# EAGLE schematic SparkFun_MP3_Breakout-VS1033D (EAGLE 7.2.0)
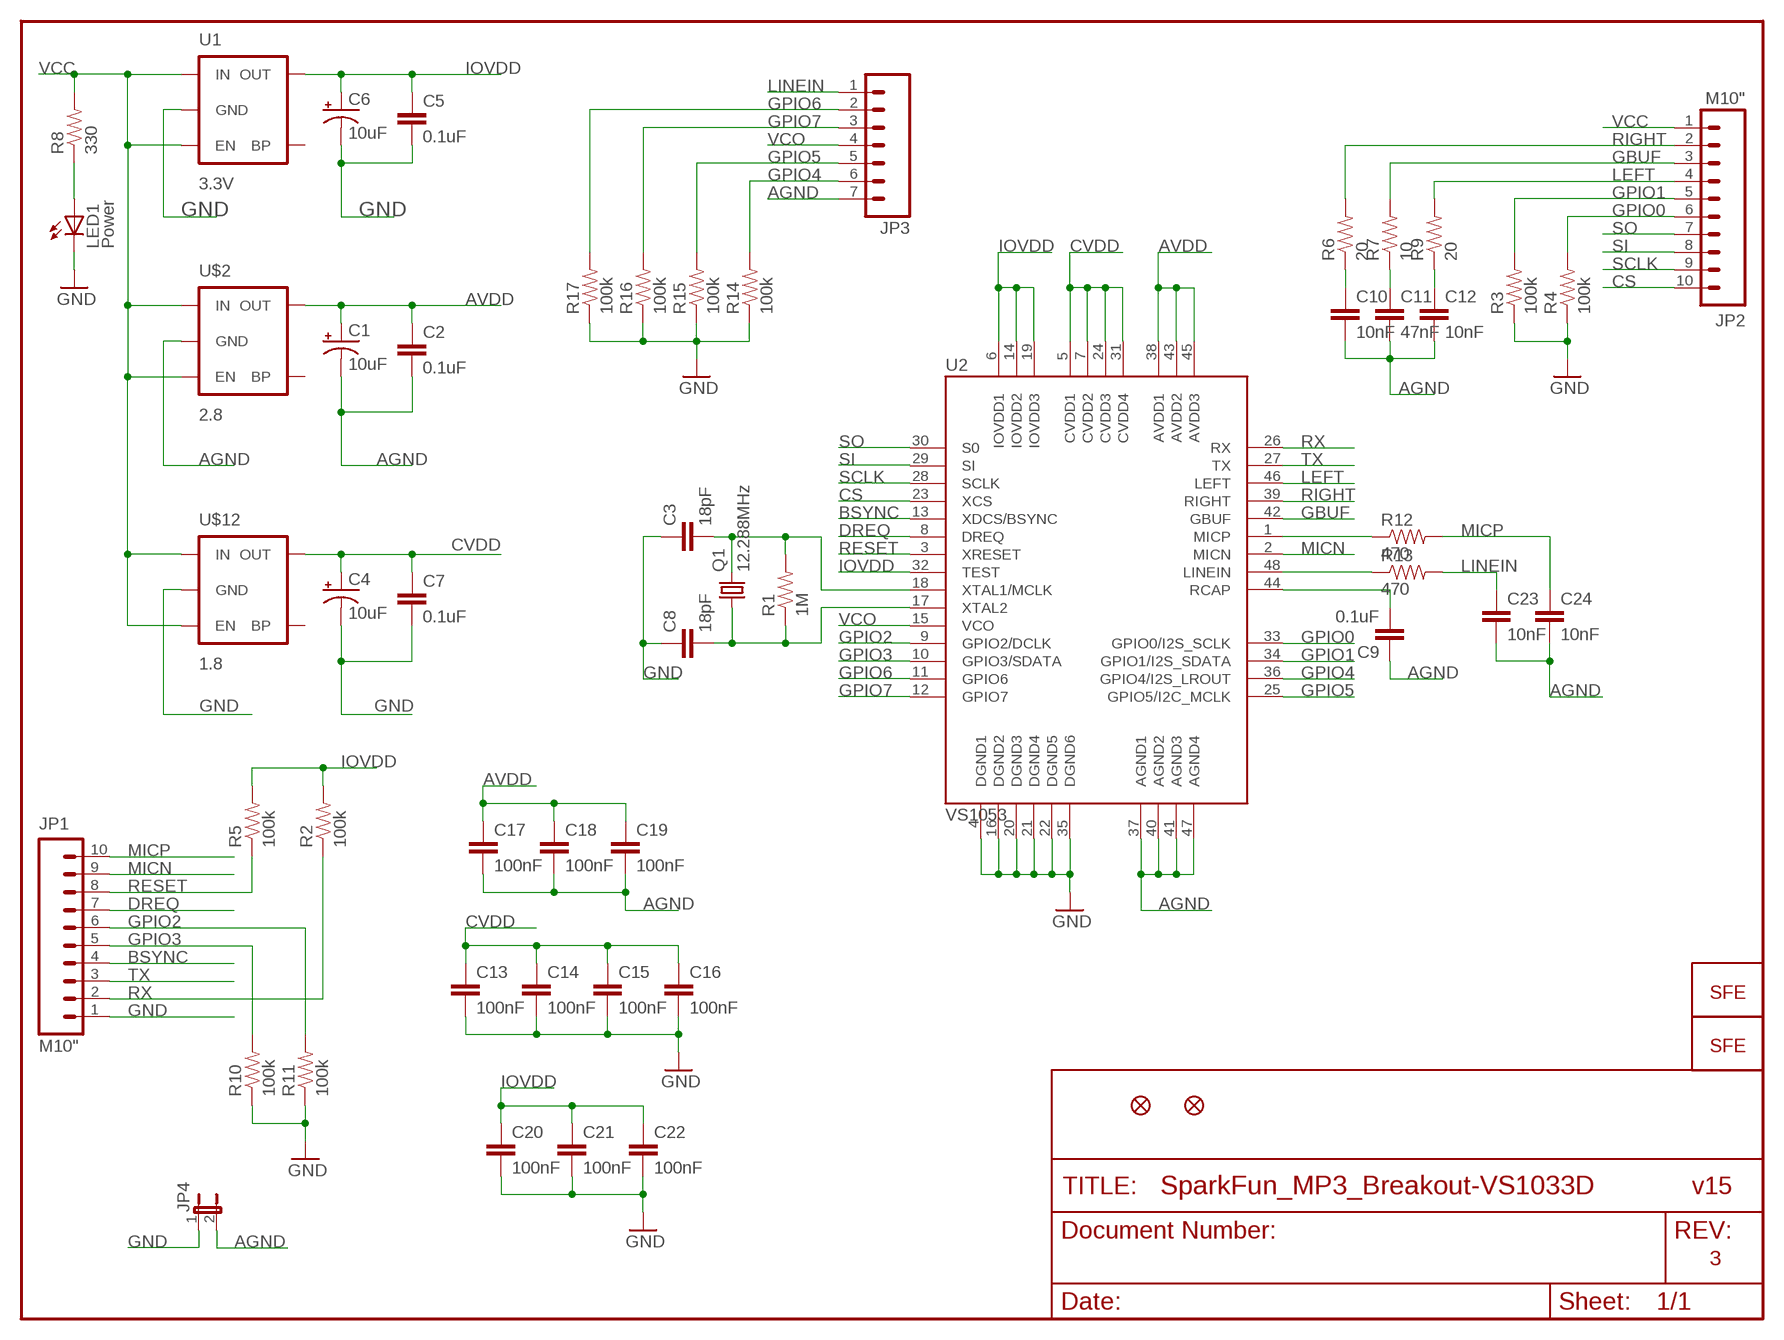
[diagram p0: schematic, sheet 1]

## Parts
C1  10uF  CAP_POL1206  [EIA3216]
C2  0.1uF  CAP0402-CAP  [0402-CAP]
C3  18pF  CAP0402-CAP  [0402-CAP]
C4  10uF  CAP_POL1206  [EIA3216]
C5  0.1uF  CAP0402-CAP  [0402-CAP]
C6  10uF  CAP_POL1206  [EIA3216]
C7  0.1uF  CAP0402-CAP  [0402-CAP]
C8  18pF  CAP0402-CAP  [0402-CAP]
C9  0.1uF  CAP0402-CAP  [0402-CAP]
C10  10nF  CAP0402-CAP  [0402-CAP]
C11  47nF  CAP0402-CAP  [0402-CAP]
C12  10nF  CAP0402-CAP  [0402-CAP]
C13  100nF  CAP0402-CAP  [0402-CAP]
C14  100nF  CAP0402-CAP  [0402-CAP]
C15  100nF  CAP0402-CAP  [0402-CAP]
C16  100nF  CAP0402-CAP  [0402-CAP]
C17  100nF  CAP0402-CAP  [0402-CAP]
C18  100nF  CAP0402-CAP  [0402-CAP]
C19  100nF  CAP0402-CAP  [0402-CAP]
C20  100nF  CAP0402-CAP  [0402-CAP]
C21  100nF  CAP0402-CAP  [0402-CAP]
C22  100nF  CAP0402-CAP  [0402-CAP]
C23  10nF  CAP0402-CAP  [0402-CAP]
C24  10nF  CAP0402-CAP  [0402-CAP]
JP1  M10"  [1X10]
JP2  M10"  [1X10]
JP3  M07  [1X07]
JP4  JUMPER-2SMD-NC  [SJ_2S]
LED1  Power  LED0603  [LED-0603]
Q1  12.288MHz  CRYSTAL5X3  [CRYSTAL-SMD-5X3]
R1  1M  RESISTOR0402-RES  [0402-RES]
R2  100k  RESISTOR0402-RES  [0402-RES]
R3  100k  RESISTOR0402-RES  [0402-RES]
R4  100k  RESISTOR0402-RES  [0402-RES]
R5  100k  RESISTOR0402-RES  [0402-RES]
R6  20  RESISTOR0402-RES  [0402-RES]
R7  10  RESISTOR0402-RES  [0402-RES]
R8  330  RESISTOR0402-RES  [0402-RES]
R9  20  RESISTOR0402-RES  [0402-RES]
R10  100k  RESISTOR0402-RES  [0402-RES]
R11  100k  RESISTOR0402-RES  [0402-RES]
R12  470  RESISTOR0402-RES  [0402-RES]
R13  470  RESISTOR0402-RES  [0402-RES]
R14  100k  RESISTOR0402-RES  [0402-RES]
R15  100k  RESISTOR0402-RES  [0402-RES]
R16  100k  RESISTOR0402-RES  [0402-RES]
R17  100k  RESISTOR0402-RES  [0402-RES]
U1  3.3V  V_REG_LDOSMD  [SOT23-5]
U2  VS1053  VS1033  [LQFP-48]
U$2  2.8  V_REG_LDOSMD2  [SC70]
U$4  FIDUCIAL1X2  [FIDUCIAL-1X2]
U$5  FIDUCIAL1X2  [FIDUCIAL-1X2]
U$6  LOGO-SFESK  [SFE-LOGO-FLAME]
U$7  LOGO-SFENEW  [SFE-NEW-WEBLOGO]
U$12  1.8  V_REG_LDOSMD2  [SC70]

## Nets
AGND: C1.C(-) C2.2 C9.1 C10.2 C11.2 C12.2 C17.2 C18.2 C19.2 C23.2 C24.2 JP3.7 JP4.2 U2.37(AGND1) U2.40(AGND2) U2.41(AGND3) U2.47(AGND4) U$2.2(GND)
AVDD: C1.A(+) C2.1 C17.1 C18.1 C19.1 U2.38(AVDD1) U2.43(AVDD2) U2.45(AVDD3) U$2.5(OUT)
BSYNC: JP1.4 U2.13(XDCS/BSYNC)
CS: JP2.10 U2.23(XCS)
CVDD: C4.A(+) C7.1 C13.1 C14.1 C15.1 C16.1 U2.5(CVDD1) U2.7(CVDD2) U2.24(CVDD3) U2.31(CVDD4) U$12.5(OUT)
DREQ: JP1.7 U2.8(DREQ)
GBUF: JP2.3 R7.2 U2.42(GBUF)
GND: C3.1 C4.C(-) C5.2 C6.C(-) C7.2 C8.1 C13.2 C14.2 C15.2 C16.2 C20.2 C21.2 C22.2 JP1.1 JP4.1 LED1.C R3.1 R4.1 R10.1 R11.1 R14.1 R15.1 R16.1 R17.1 U1.2(GND) U2.4(DGND1) U2.16(DGND2) U2.20(DGND3) U2.21(DGND4) U2.22(DGND5) U2.35(DGND6) U$12.2(GND)
GPIO0: JP2.6 R4.2 U2.33(GPIO0/I2S_SCLK)
GPIO1: JP2.5 R3.2 U2.34(GPIO1/I2S_SDATA)
GPIO2: JP1.6 R11.2 U2.9(GPIO2/DCLK)
GPIO3: JP1.5 R10.2 U2.10(GPIO3/SDATA)
GPIO4: JP3.6 R14.2 U2.36(GPIO4/I2S_LROUT)
GPIO5: JP3.5 R15.2 U2.25(GPIO5/I2C_MCLK)
GPIO6: JP3.2 R17.2 U2.11(GPIO6)
GPIO7: JP3.3 R16.2 U2.12(GPIO7)
IOVDD: C5.1 C6.A(+) C20.1 C21.1 C22.1 R2.2 R5.2 U1.5(OUT) U2.6(IOVDD1) U2.14(IOVDD2) U2.19(IOVDD3) U2.32(TEST)
LEFT: JP2.4 R9.2 U2.46(LEFT)
LINEIN: C23.1 JP3.1 R13.2
MICN: JP1.9 U2.2(MICN)
MICP: C24.1 JP1.10 R12.2
N$1: C9.2 U2.44(RCAP)
N$2: C12.1 R9.1
N$3: C10.1 R6.1
N$4: R12.1 U2.1(MICP)
N$5: C11.1 R7.1
N$6: LED1.A R8.1
N$7: R13.1 U2.48(LINEIN)
N$9: C3.2 Q1.3 R1.2 U2.18(XTAL1/MCLK)
N$10: C8.2 Q1.1 R1.1 U2.17(XTAL2)
RESET: JP1.8 R5.1 U2.3(XRESET)
RIGHT: JP2.2 R6.2 U2.39(RIGHT)
RX: JP1.2 R2.1 U2.26(RX)
SCLK: JP2.9 U2.28(SCLK)
SI: JP2.8 U2.29(SI)
SO: JP2.7 U2.30(S0)
TX: JP1.3 U2.27(TX)
VCC: JP2.1 R8.2 U1.1(IN) U1.3(EN) U$2.1(IN) U$2.3(EN) U$12.1(IN) U$12.3(EN)
VCO: JP3.4 U2.15(VCO)
Unconnected: U1.4(BP) U$2.4(BP) U$12.4(BP)

## Notes on the sheet
- v15
- 3

## Library data of the parts
C1 C4 C6 = SparkFun:CAP_POL: Capacitor Polarized These are standard SMD and PTH capacitors. Normally 10uF, 47uF, and 100uF in electrolytic and tantalum varieties. Always verify the external diameter of the through hole cap, it varies with capacity, voltage, and manufacturer. The EIA devices should be standard.
C2 C3 C5 C7-C24 = SparkFun:CAP: Capacitor Standard 0603 ceramic capacitor, and 0.1" leaded capacitor.
JP1 JP2 = SparkFun:M10: Header 10 Standard 10-pin 0.1" header. Use with straight break away headers (SKU : PRT-00116), right angle break away headers (PRT-00553), swiss pins (PRT-00743), machine pins (PRT-00117), and female headers (PRT-00115).
JP3 = SparkFun:M07: Header 7 Standard 7-pin 0.1" header. Use with straight break away headers (SKU : PRT-00116), right angle break away headers (PRT-00553), swiss pins (PRT-00743), machine pins (PRT-00117), and female headers (PRT-00115). NOTES ON THE VARIANTS LOCK and LOCK_LONGPADS... This footprint was designed to help hold the alignment of a through-hole component (i.e. 7-pin header) while soldering it into place. You may notice that each hole has been shifted either up or down by 0.005 of an inch from it's more standard position (which is usually a perfectly straight line). This slight alteration caused the pins (the squares in the middle) to touch the edges of the holes. Because they are alternating, it causes a "brace" to hold the header in place. 0.005 has proven to be the perfect amount of "off-center" position when using our standard breakaway headers. Although looks a little odd when you look at the bare footprint, once you have a header in there, the alteration is very hard to notice. Also, if you push a header all the way into place, it is covered up entirely on the bottom side. This idea of altering the position of holes to aid alignment will be further integrated into the Sparkfun Library for other footprints. It can help hold any component with 3 or more connection pins.
JP4 = SparkFun:JUMPER-2: Jumper Basic 0.1" spaced jumper. Use with breakaway headers.
LED1 = SparkFun:LED: LEDs Standard schematic elements and footprints for 5mm, 3mm, 1206, and 0603 sized LEDs. 5mm - Spark Fun Electronics SKU : COM-00529 (and others)
Q1 = SparkFun:CRYSTAL: Crystals Various standard crystals. Proven footprints. Spark Fun Electronics SKU : COM-00534
R1-R17 = SparkFun:RESISTOR: Resistor Basic schematic elements and footprints for 0603, 1206, and PTH resistors.
U1 U$2 U$12 = SparkFun:V_REG_LDO: Voltage Regulator LDO Standard 150mA LDO voltage regulator in SOT-23 layout. Micrel part MIC5205. BP (by-pass) pin is used to lower output noise with 470pF cap.
U2 = SparkFun:VS1033
U$4 U$5 = SparkFun:FIDUCIAL: Fiducial Alignment Points Various fiducial points for machine vision alignment.
U$6 U$7 = SparkFun:LOGO-SFE: Spark Fun Electronics PCB Logo This is the standard Spark Fun Electronics PCB logo.